# Altium schematic sheet Module Output Sockets.SchDoc: Module Output Sockets
size A2; DocumentNumber: 29; SheetNumber: 29; SheetTotal: 54
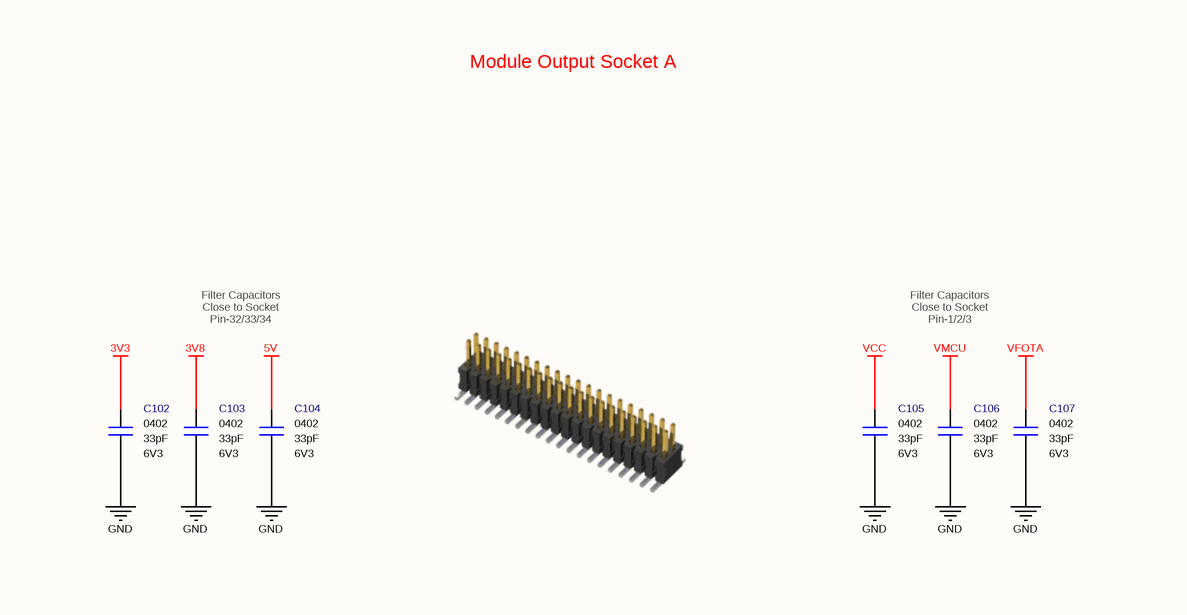
[diagram p0: Module Output Sockets.SchDoc, top left]
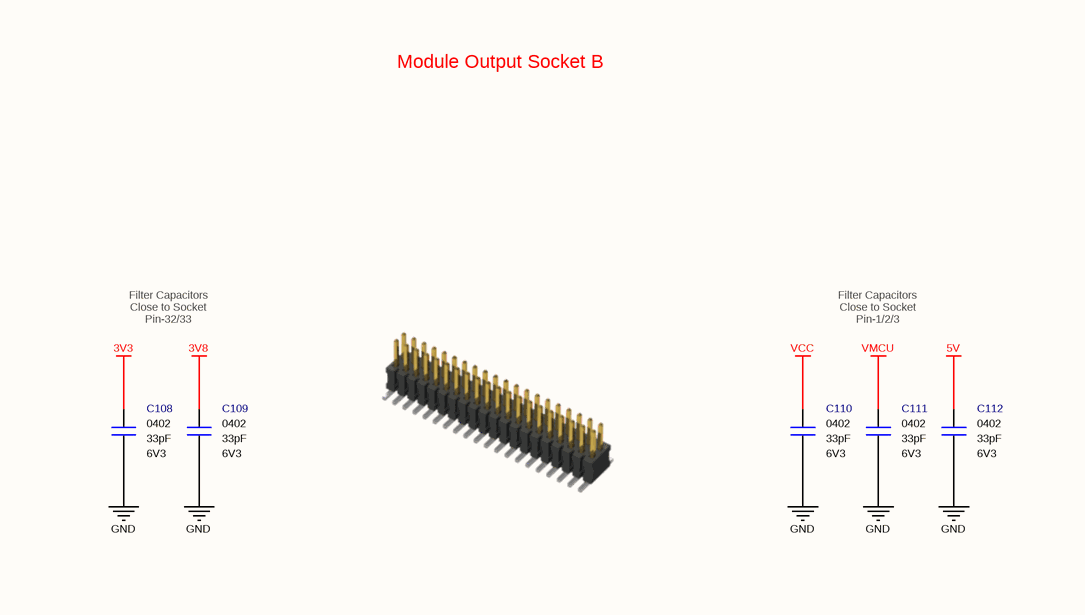
[diagram p1: Module Output Sockets.SchDoc, top right]
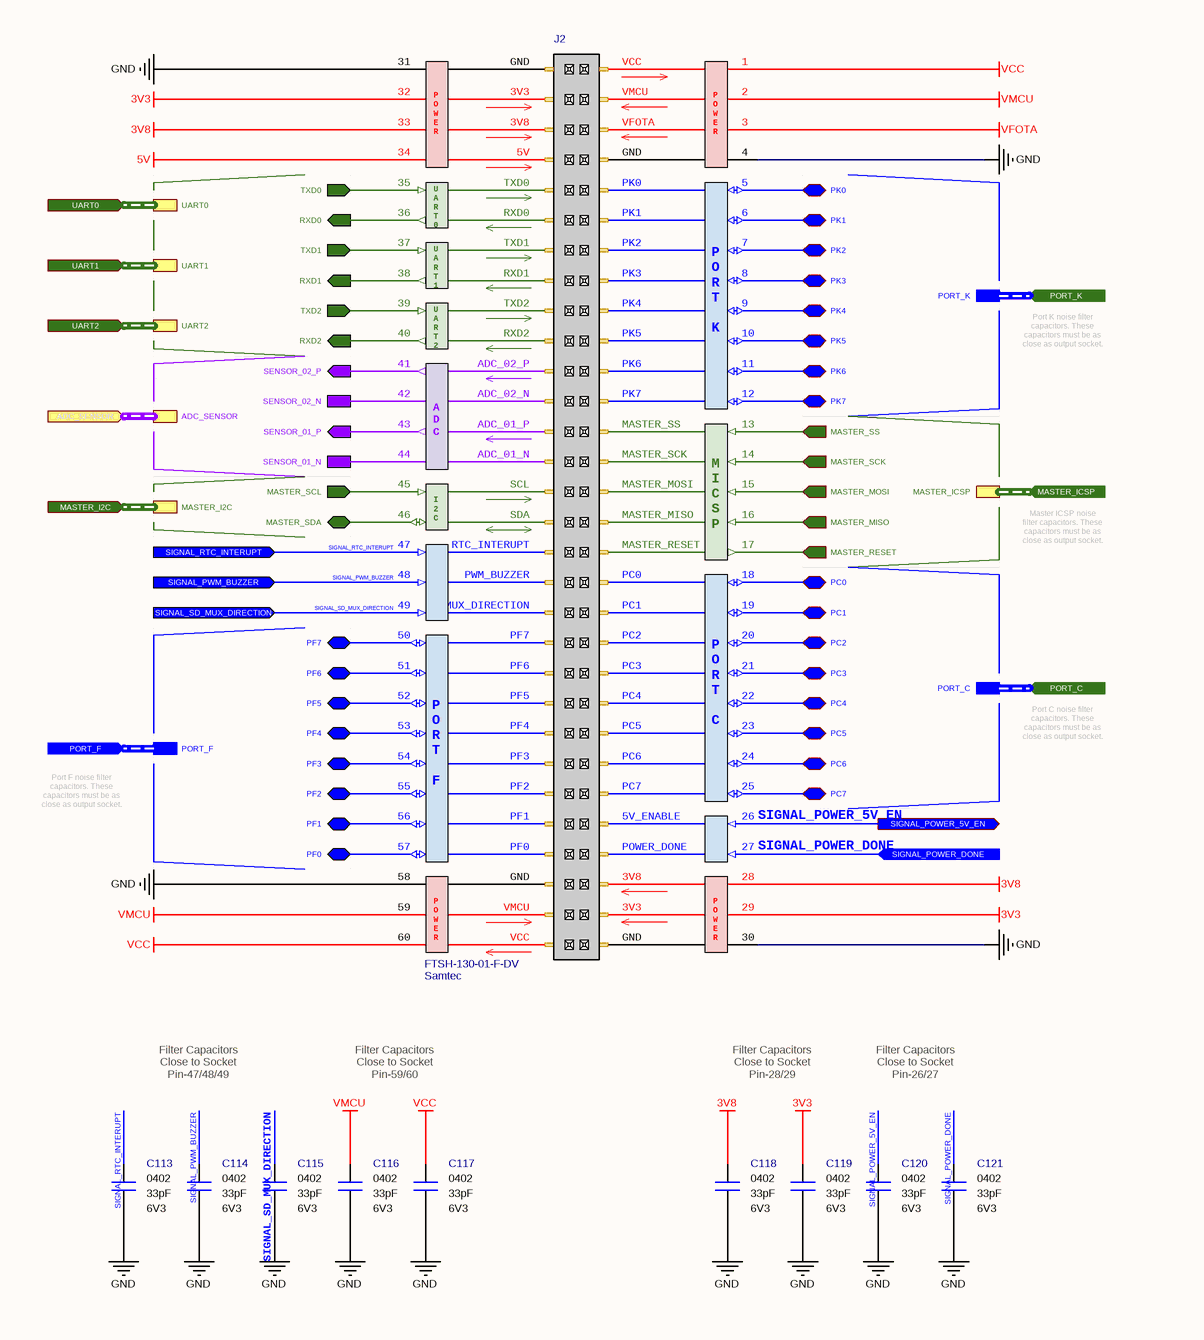
[diagram p2: Module Output Sockets.SchDoc, bottom left]
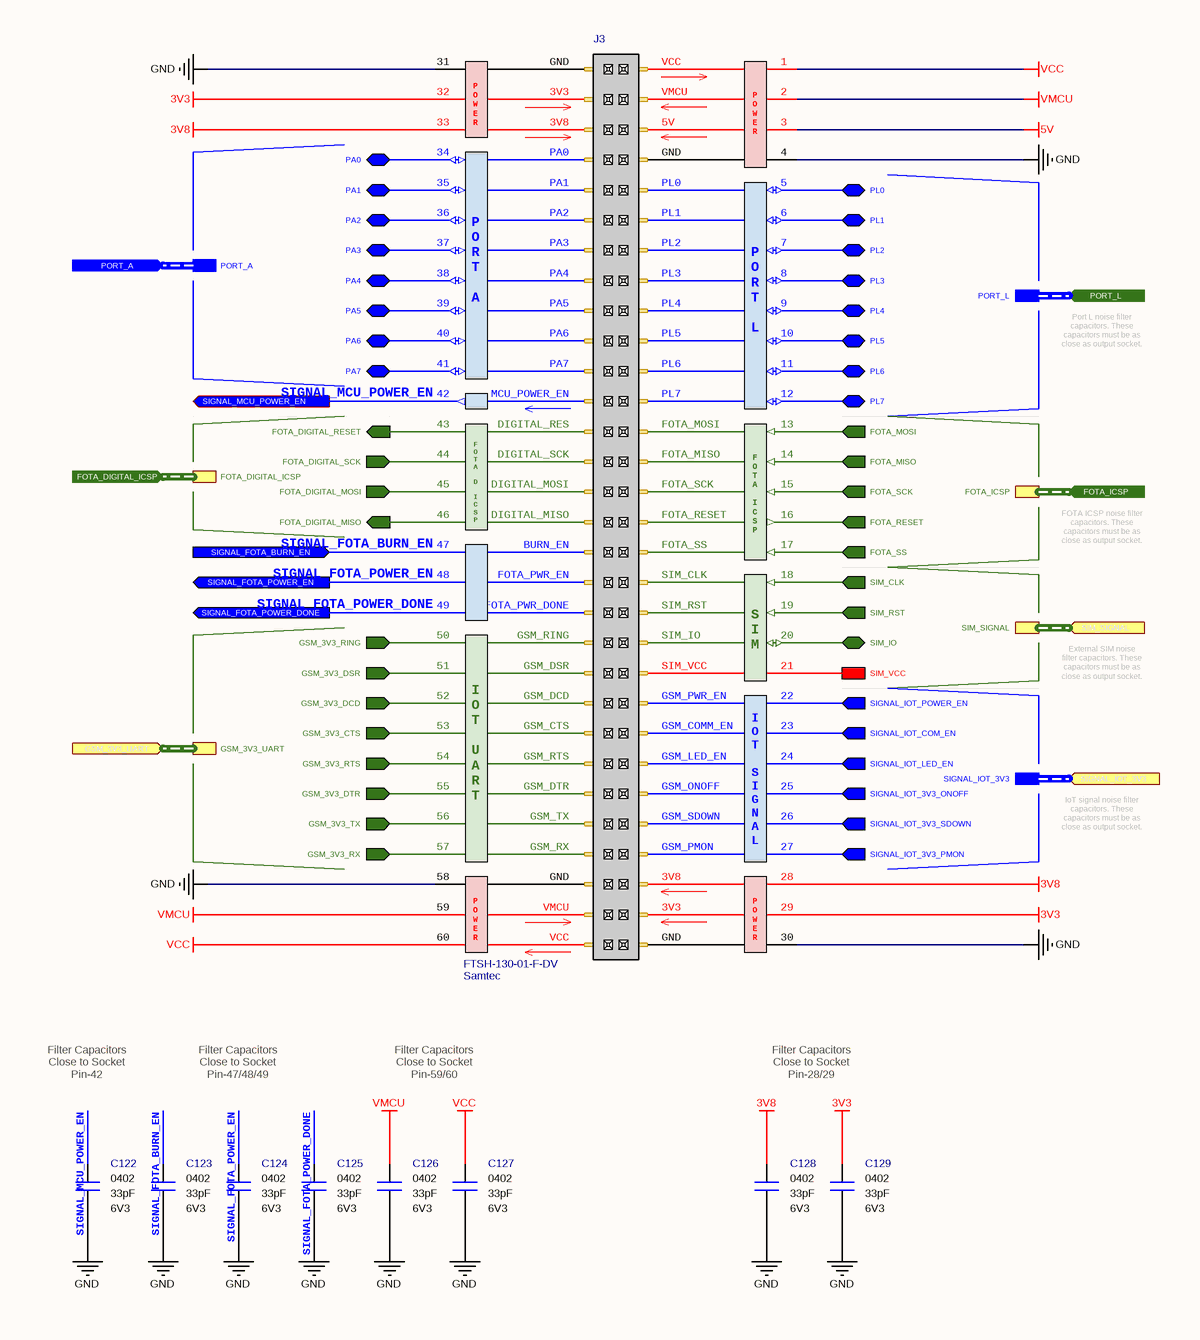
[diagram p3: Module Output Sockets.SchDoc, bottom right]

## Parts
C102  value 33pF  Case: 0402  Voltage: 6V3  [CAPACITOR_0402]  (hidden comment: Multilayer Ceramic Capacitor)
C103  value 33pF  Case: 0402  Voltage: 6V3  [CAPACITOR_0402]  (hidden comment: Multilayer Ceramic Capacitor)
C104  value 33pF  Case: 0402  Voltage: 6V3  [CAPACITOR_0402]  (hidden comment: Multilayer Ceramic Capacitor)
C105  value 33pF  Case: 0402  Voltage: 6V3  [CAPACITOR_0402]  (hidden comment: Multilayer Ceramic Capacitor)
C106  value 33pF  Case: 0402  Voltage: 6V3  [CAPACITOR_0402]  (hidden comment: Multilayer Ceramic Capacitor)
C107  value 33pF  Case: 0402  Voltage: 6V3  [CAPACITOR_0402]  (hidden comment: Multilayer Ceramic Capacitor)
C108  value 33pF  Case: 0402  Voltage: 6V3  [CAPACITOR_0402]  (hidden comment: Multilayer Ceramic Capacitor)
C109  value 33pF  Case: 0402  Voltage: 6V3  [CAPACITOR_0402]  (hidden comment: Multilayer Ceramic Capacitor)
C110  value 33pF  Case: 0402  Voltage: 6V3  [CAPACITOR_0402]  (hidden comment: Multilayer Ceramic Capacitor)
C111  value 33pF  Case: 0402  Voltage: 6V3  [CAPACITOR_0402]  (hidden comment: Multilayer Ceramic Capacitor)
C112  value 33pF  Case: 0402  Voltage: 6V3  [CAPACITOR_0402]  (hidden comment: Multilayer Ceramic Capacitor)
C113  value 33pF  Case: 0402  Voltage: 6V3  [CAPACITOR_0402]  (hidden comment: Multilayer Ceramic Capacitor)
C114  value 33pF  Case: 0402  Voltage: 6V3  [CAPACITOR_0402]  (hidden comment: Multilayer Ceramic Capacitor)
C115  value 33pF  Case: 0402  Voltage: 6V3  [CAPACITOR_0402]  (hidden comment: Multilayer Ceramic Capacitor)
C116  value 33pF  Case: 0402  Voltage: 6V3  [CAPACITOR_0402]  (hidden comment: Multilayer Ceramic Capacitor)
C117  value 33pF  Case: 0402  Voltage: 6V3  [CAPACITOR_0402]  (hidden comment: Multilayer Ceramic Capacitor)
C118  value 33pF  Case: 0402  Voltage: 6V3  [CAPACITOR_0402]  (hidden comment: Multilayer Ceramic Capacitor)
C119  value 33pF  Case: 0402  Voltage: 6V3  [CAPACITOR_0402]  (hidden comment: Multilayer Ceramic Capacitor)
C120  value 33pF  Case: 0402  Voltage: 6V3  [CAPACITOR_0402]  (hidden comment: Multilayer Ceramic Capacitor)
C121  value 33pF  Case: 0402  Voltage: 6V3  [CAPACITOR_0402]  (hidden comment: Multilayer Ceramic Capacitor)
C122  value 33pF  Case: 0402  Voltage: 6V3  [CAPACITOR_0402]  (hidden comment: Multilayer Ceramic Capacitor)
C123  value 33pF  Case: 0402  Voltage: 6V3  [CAPACITOR_0402]  (hidden comment: Multilayer Ceramic Capacitor)
C124  value 33pF  Case: 0402  Voltage: 6V3  [CAPACITOR_0402]  (hidden comment: Multilayer Ceramic Capacitor)
C125  value 33pF  Case: 0402  Voltage: 6V3  [CAPACITOR_0402]  (hidden comment: Multilayer Ceramic Capacitor)
C126  value 33pF  Case: 0402  Voltage: 6V3  [CAPACITOR_0402]  (hidden comment: Multilayer Ceramic Capacitor)
C127  value 33pF  Case: 0402  Voltage: 6V3  [CAPACITOR_0402]  (hidden comment: Multilayer Ceramic Capacitor)
C128  value 33pF  Case: 0402  Voltage: 6V3  [CAPACITOR_0402]  (hidden comment: Multilayer Ceramic Capacitor)
C129  value 33pF  Case: 0402  Voltage: 6V3  [CAPACITOR_0402]  (hidden comment: Multilayer Ceramic Capacitor)
J2  Manufacturer Part Number: FTSH-130-01-F-DV  Manufacturer Name: Samtec  [SAMTEC-FTSH-130-01-X-DV]  (hidden comment: 1.27 mm Pitch 2x30P Male Connector)
J3  Manufacturer Part Number: FTSH-130-01-F-DV  Manufacturer Name: Samtec  [SAMTEC-FTSH-130-01-X-DV]  (hidden comment: 1.27 mm Pitch 2x30P Male Connector)

## Sub-sheets
ADC Sensor Filter Capacitors = Filter Capacitors - ADC Sensor.SchDoc: ADC_SENSOR (harness ADC_SENSOR), SENSOR_01_N, SENSOR_01_P (in), SENSOR_02_N, SENSOR_02_P (in)
FOTA Digital ICSP Filter Capacitors = Filter Capacitors - FOTA Digital ICSP.SchDoc: FOTA_DIGITAL_ICSP (harness FOTA_DIGITAL_ICSP), FOTA_DIGITAL_MISO (in), FOTA_DIGITAL_MOSI (out), FOTA_DIGITAL_SCK (out), FOTA_DIGITAL_RESET (in)
FOTA ICSP Filter Capacitors = Filter Capacitors - FOTA ICSP.SchDoc: FOTA_ICSP (harness FOTA_ICSP), FOTA_MOSI (out), FOTA_SS (out), FOTA_MISO (out), FOTA_SCK (out), FOTA_RESET (out)
I2C Filter Capacitors = Filter Capacitors - I2C.SchDoc: MASTER_I2C (harness MASTER_I2C), MASTER_SDA (bidir), MASTER_SCL (out)
IoT UART Filter Capacitors = Filter Capacitors - IoT UART.SchDoc: GSM_3V3_UART (harness GSM_3V3_UART), GSM_3V3_RTS (out), GSM_3V3_RING (out), GSM_3V3_CTS (out), GSM_3V3_DTR (out), GSM_3V3_DCD (out), GSM_3V3_RX (out), GSM_3V3_DSR (out), GSM_3V3_TX (out)
Master ICSP Filter Capacitors = Filter Capacitors - Master ICSP.SchDoc: MASTER_ICSP (harness MASTER_ICSP), MASTER_SS (out), MASTER_RESET (out), MASTER_SCK (out), MASTER_MOSI (out), MASTER_MISO (out)
PORT A Filter Capacitors = Filter Capacitors - Port A.SchDoc: PA4 (bidir), PA2 (bidir), PA0 (bidir), PA5 (bidir), PA3 (bidir), PA1 (bidir), PA7 (bidir), PA6 (bidir), PORT_A (harness PORT_A)
PORT C Filter Capacitors = Filter Capacitors - Port C.SchDoc: PC4 (bidir), PC2 (bidir), PC0 (bidir), PC5 (bidir), PC3 (bidir), PC1 (bidir), PC7 (bidir), PC6 (bidir), PORT_C (harness PORT_C)
PORT F Filter Capacitors = Filter Capacitors - Port F.SchDoc: PF4 (bidir), PF2 (bidir), PF0 (bidir), PF5 (bidir), PF3 (bidir), PF1 (bidir), PF7 (bidir), PF6 (bidir), PORT_F (harness PORT_F)
PORT K Filter Capacitors = Filter Capacitors - Port K.SchDoc: PK4 (bidir), PK2 (bidir), PK0 (bidir), PK5 (bidir), PK3 (bidir), PK1 (bidir), PK7 (bidir), PK6 (bidir), PORT_K (harness PORT_K)
PORT L Filter Capacitors = Filter Capacitors - Port L.SchDoc: PL4 (bidir), PL2 (bidir), PL0 (bidir), PL5 (bidir), PL3 (bidir), PL1 (bidir), PL7 (bidir), PL6 (bidir), PORT_L (harness PORT_L)
Serial Communication Filter Capacitors = Filter Capacitors - Serial Communication.SchDoc: UART0 (harness UART0), TXD2 (out), UART2 (harness UART2), TXD1 (out), RXD1 (in), RXD0 (in), TXD0 (out), UART1 (harness UART1), RXD2 (in)
Signal IoT Filter Capacitors = Filter Capacitors - Signal IoT.SchDoc: SIGNAL_IOT_3V3_SDOWN (out), SIGNAL_IOT_LED_EN (out), SIGNAL_IOT_POWER_EN (out), SIGNAL_IOT_3V3_PMON (out), SIGNAL_IOT_3V3_ONOFF (out), SIGNAL_IOT_COM_EN (out), SIGNAL_IOT_3V3 (harness SIGNAL_IOT_3V3)
SIM Signal Filter Capacitors = Filter Capacitors - External SIM.SchDoc: SIM_SIGNAL (harness SIM_SIGNAL), SIM_CLK (out), SIM_RST (out), SIM_IO (bidir), SIM_VCC

## Ports
ADC_SENSOR (in, harness ADC_SENSOR), FOTA_DIGITAL_ICSP (in, harness FOTA_DIGITAL_ICSP), FOTA_ICSP (in, harness FOTA_ICSP), GSM_3V3_UART (in, harness GSM_3V3_UART), MASTER_I2C (in, harness MASTER_I2C), MASTER_ICSP (in, harness MASTER_ICSP), PORT_A (in, harness PORT_A), PORT_C (in, harness PORT_C), PORT_F (in, harness PORT_F), PORT_K (in, harness PORT_K), PORT_L (in, harness PORT_L), SIGNAL_FOTA_BURN_EN (in), SIGNAL_FOTA_POWER_DONE (out), SIGNAL_FOTA_POWER_EN (out), SIGNAL_IOT_3V3 (in, harness SIGNAL_IOT_3V3), SIGNAL_MCU_POWER_EN (out), SIGNAL_POWER_5V_EN (out), SIGNAL_POWER_DONE (in), SIGNAL_PWM_BUZZER (in), SIGNAL_RTC_INTERUPT (in), SIGNAL_SD_MUX_DIRECTION (in), SIM_SIGNAL (in, harness SIM_SIGNAL), UART0 (in, harness UART0), UART1 (in, harness UART1), UART2 (in, harness UART2)

## Nets
3V3: C102.2 C108.2 C119.2 C129.2 J2.29(Pin-29) J2.32(Pin-32) J3.29(Pin-29) J3.32(Pin-32)
3V8: C103.2 C109.2 C118.2 C128.2 J2.28(Pin-28) J2.33(Pin-33) J3.28(Pin-28) J3.33(Pin-33)
5V: C104.2 C112.2 J2.34(Pin-34) J3.3(Pin-3)
GND: C102.1 C103.1 C104.1 C105.1 C106.1 C107.1 C108.1 C109.1 C110.1 C111.1 C112.1 C113.1 C114.1 C115.1 C116.1 C117.1 C118.1 C119.1 C120.1 C121.1 C122.1 C123.1 C124.1 C125.1 C126.1 C127.1 C128.1 C129.1 J2.4(Pin-4) J2.30(Pin-30) J2.31(Pin-31) J2.58(Pin-58) J3.4(Pin-4) J3.30(Pin-30) J3.31(Pin-31) J3.58(Pin-58)
VCC: C105.2 C110.2 C117.2 C127.2 J2.1(Pin-1) J2.60(Pin-60) J3.1(Pin-1) J3.60(Pin-60)
VFOTA: C107.2 J2.3(Pin-3)
VMCU: C106.2 C111.2 C116.2 C126.2 J2.2(Pin-2) J2.59(Pin-59) J3.2(Pin-2) J3.59(Pin-59)
SIGNAL_FOTA_BURN_EN: C123.2 J3.47(Pin-47) ; port SIGNAL_FOTA_BURN_EN
SIGNAL_FOTA_POWER_DONE: C125.2 J3.49(Pin-49) ; port SIGNAL_FOTA_POWER_DONE
SIGNAL_FOTA_POWER_EN: C124.2 J3.48(Pin-48) ; port SIGNAL_FOTA_POWER_EN
SIGNAL_MCU_POWER_EN: C122.2 J3.42(Pin-42) ; port SIGNAL_MCU_POWER_EN
SIGNAL_POWER_5V_EN: C120.2 J2.26(Pin-26) ; port SIGNAL_POWER_5V_EN
SIGNAL_POWER_DONE: C121.2 J2.27(Pin-27) ; port SIGNAL_POWER_DONE
SIGNAL_PWM_BUZZER: C114.2 J2.48(Pin-48) ; port SIGNAL_PWM_BUZZER
SIGNAL_RTC_INTERUPT: C113.2 J2.47(Pin-47) ; port SIGNAL_RTC_INTERUPT
SIGNAL_SD_MUX_DIRECTION: C115.2 J2.49(Pin-49) ; port SIGNAL_SD_MUX_DIRECTION
NetJ2_5: J2.5(Pin-5) ; sheet PORT K Filter Capacitors/PK0
NetJ2_6: J2.6(Pin-6) ; sheet PORT K Filter Capacitors/PK1
NetJ2_7: J2.7(Pin-7) ; sheet PORT K Filter Capacitors/PK2
NetJ2_8: J2.8(Pin-8) ; sheet PORT K Filter Capacitors/PK3
NetJ2_9: J2.9(Pin-9) ; sheet PORT K Filter Capacitors/PK4
NetJ2_10: J2.10(Pin-10) ; sheet PORT K Filter Capacitors/PK5
NetJ2_11: J2.11(Pin-11) ; sheet PORT K Filter Capacitors/PK6
NetJ2_12: J2.12(Pin-12) ; sheet PORT K Filter Capacitors/PK7
NetJ2_13: J2.13(Pin-13) ; sheet Master ICSP Filter Capacitors/MASTER_SS
NetJ2_14: J2.14(Pin-14) ; sheet Master ICSP Filter Capacitors/MASTER_SCK
NetJ2_15: J2.15(Pin-15) ; sheet Master ICSP Filter Capacitors/MASTER_MOSI
NetJ2_16: J2.16(Pin-16) ; sheet Master ICSP Filter Capacitors/MASTER_MISO
NetJ2_17: J2.17(Pin-17) ; sheet Master ICSP Filter Capacitors/MASTER_RESET
NetJ2_18: J2.18(Pin-18) ; sheet PORT C Filter Capacitors/PC0
NetJ2_19: J2.19(Pin-19) ; sheet PORT C Filter Capacitors/PC1
NetJ2_20: J2.20(Pin-20) ; sheet PORT C Filter Capacitors/PC2
NetJ2_21: J2.21(Pin-21) ; sheet PORT C Filter Capacitors/PC3
NetJ2_22: J2.22(Pin-22) ; sheet PORT C Filter Capacitors/PC4
NetJ2_23: J2.23(Pin-23) ; sheet PORT C Filter Capacitors/PC5
NetJ2_24: J2.24(Pin-24) ; sheet PORT C Filter Capacitors/PC6
NetJ2_25: J2.25(Pin-25) ; sheet PORT C Filter Capacitors/PC7
NetJ2_35: J2.35(Pin-35) ; sheet Serial Communication Filter Capacitors/TXD0
NetJ2_36: J2.36(Pin-36) ; sheet Serial Communication Filter Capacitors/RXD0
NetJ2_37: J2.37(Pin-37) ; sheet Serial Communication Filter Capacitors/TXD1
NetJ2_38: J2.38(Pin-38) ; sheet Serial Communication Filter Capacitors/RXD1
NetJ2_39: J2.39(Pin-39) ; sheet Serial Communication Filter Capacitors/TXD2
NetJ2_40: J2.40(Pin-40) ; sheet Serial Communication Filter Capacitors/RXD2
NetJ2_41: J2.41(Pin-41) ; sheet ADC Sensor Filter Capacitors/SENSOR_02_P
NetJ2_42: J2.42(Pin-42) ; sheet ADC Sensor Filter Capacitors/SENSOR_02_N
NetJ2_43: J2.43(Pin-43) ; sheet ADC Sensor Filter Capacitors/SENSOR_01_P
NetJ2_44: J2.44(Pin-44) ; sheet ADC Sensor Filter Capacitors/SENSOR_01_N
NetJ2_45: J2.45(Pin-45) ; sheet I2C Filter Capacitors/MASTER_SCL
NetJ2_46: J2.46(Pin-46) ; sheet I2C Filter Capacitors/MASTER_SDA
NetJ2_50: J2.50(Pin-50) ; sheet PORT F Filter Capacitors/PF7
NetJ2_51: J2.51(Pin-51) ; sheet PORT F Filter Capacitors/PF6
NetJ2_52: J2.52(Pin-52) ; sheet PORT F Filter Capacitors/PF5
NetJ2_53: J2.53(Pin-53) ; sheet PORT F Filter Capacitors/PF4
NetJ2_54: J2.54(Pin-54) ; sheet PORT F Filter Capacitors/PF3
NetJ2_55: J2.55(Pin-55) ; sheet PORT F Filter Capacitors/PF2
NetJ2_56: J2.56(Pin-56) ; sheet PORT F Filter Capacitors/PF1
NetJ2_57: J2.57(Pin-57) ; sheet PORT F Filter Capacitors/PF0
NetJ3_5: J3.5(Pin-5) ; sheet PORT L Filter Capacitors/PL0
NetJ3_6: J3.6(Pin-6) ; sheet PORT L Filter Capacitors/PL1
NetJ3_7: J3.7(Pin-7) ; sheet PORT L Filter Capacitors/PL2
NetJ3_8: J3.8(Pin-8) ; sheet PORT L Filter Capacitors/PL3
NetJ3_9: J3.9(Pin-9) ; sheet PORT L Filter Capacitors/PL4
NetJ3_10: J3.10(Pin-10) ; sheet PORT L Filter Capacitors/PL5
NetJ3_11: J3.11(Pin-11) ; sheet PORT L Filter Capacitors/PL6
NetJ3_12: J3.12(Pin-12) ; sheet PORT L Filter Capacitors/PL7
NetJ3_13: J3.13(Pin-13) ; sheet FOTA ICSP Filter Capacitors/FOTA_MOSI
NetJ3_14: J3.14(Pin-14) ; sheet FOTA ICSP Filter Capacitors/FOTA_MISO
NetJ3_15: J3.15(Pin-15) ; sheet FOTA ICSP Filter Capacitors/FOTA_SCK
NetJ3_16: J3.16(Pin-16) ; sheet FOTA ICSP Filter Capacitors/FOTA_RESET
NetJ3_17: J3.17(Pin-17) ; sheet FOTA ICSP Filter Capacitors/FOTA_SS
NetJ3_18: J3.18(Pin-18) ; sheet SIM Signal Filter Capacitors/SIM_CLK
NetJ3_19: J3.19(Pin-19) ; sheet SIM Signal Filter Capacitors/SIM_RST
NetJ3_20: J3.20(Pin-20) ; sheet SIM Signal Filter Capacitors/SIM_IO
NetJ3_21: J3.21(Pin-21) ; sheet SIM Signal Filter Capacitors/SIM_VCC
NetJ3_22: J3.22(Pin-22) ; sheet Signal IoT Filter Capacitors/SIGNAL_IOT_POWER_EN
NetJ3_23: J3.23(Pin-23) ; sheet Signal IoT Filter Capacitors/SIGNAL_IOT_COM_EN
NetJ3_24: J3.24(Pin-24) ; sheet Signal IoT Filter Capacitors/SIGNAL_IOT_LED_EN
NetJ3_25: J3.25(Pin-25) ; sheet Signal IoT Filter Capacitors/SIGNAL_IOT_3V3_ONOFF
NetJ3_26: J3.26(Pin-26) ; sheet Signal IoT Filter Capacitors/SIGNAL_IOT_3V3_SDOWN
NetJ3_27: J3.27(Pin-27) ; sheet Signal IoT Filter Capacitors/SIGNAL_IOT_3V3_PMON
NetJ3_34: J3.34(Pin-34) ; sheet PORT A Filter Capacitors/PA0
NetJ3_35: J3.35(Pin-35) ; sheet PORT A Filter Capacitors/PA1
NetJ3_36: J3.36(Pin-36) ; sheet PORT A Filter Capacitors/PA2
NetJ3_37: J3.37(Pin-37) ; sheet PORT A Filter Capacitors/PA3
NetJ3_38: J3.38(Pin-38) ; sheet PORT A Filter Capacitors/PA4
NetJ3_39: J3.39(Pin-39) ; sheet PORT A Filter Capacitors/PA5
NetJ3_40: J3.40(Pin-40) ; sheet PORT A Filter Capacitors/PA6
NetJ3_41: J3.41(Pin-41) ; sheet PORT A Filter Capacitors/PA7
NetJ3_43: J3.43(Pin-43) ; sheet FOTA Digital ICSP Filter Capacitors/FOTA_DIGITAL_RESET
NetJ3_44: J3.44(Pin-44) ; sheet FOTA Digital ICSP Filter Capacitors/FOTA_DIGITAL_SCK
NetJ3_45: J3.45(Pin-45) ; sheet FOTA Digital ICSP Filter Capacitors/FOTA_DIGITAL_MOSI
NetJ3_46: J3.46(Pin-46) ; sheet FOTA Digital ICSP Filter Capacitors/FOTA_DIGITAL_MISO
NetJ3_50: J3.50(Pin-50) ; sheet IoT UART Filter Capacitors/GSM_3V3_RING
NetJ3_51: J3.51(Pin-51) ; sheet IoT UART Filter Capacitors/GSM_3V3_DSR
NetJ3_52: J3.52(Pin-52) ; sheet IoT UART Filter Capacitors/GSM_3V3_DCD
NetJ3_53: J3.53(Pin-53) ; sheet IoT UART Filter Capacitors/GSM_3V3_CTS
NetJ3_54: J3.54(Pin-54) ; sheet IoT UART Filter Capacitors/GSM_3V3_RTS
NetJ3_55: J3.55(Pin-55) ; sheet IoT UART Filter Capacitors/GSM_3V3_DTR
NetJ3_56: J3.56(Pin-56) ; sheet IoT UART Filter Capacitors/GSM_3V3_TX
NetJ3_57: J3.57(Pin-57) ; sheet IoT UART Filter Capacitors/GSM_3V3_RX

## Buses and harness runs
harness port ADC_SENSOR = sheet ADC Sensor Filter Capacitors/ADC_SENSOR
harness port FOTA_DIGITAL_ICSP = sheet FOTA Digital ICSP Filter Capacitors/FOTA_DIGITAL_ICSP
harness port FOTA_ICSP = sheet FOTA ICSP Filter Capacitors/FOTA_ICSP
harness port GSM_3V3_UART = sheet IoT UART Filter Capacitors/GSM_3V3_UART
harness port MASTER_I2C = sheet I2C Filter Capacitors/MASTER_I2C
harness port MASTER_ICSP = sheet Master ICSP Filter Capacitors/MASTER_ICSP
harness port PORT_A = sheet PORT A Filter Capacitors/PORT_A
harness port PORT_C = sheet PORT C Filter Capacitors/PORT_C
harness port PORT_F = sheet PORT F Filter Capacitors/PORT_F
harness port PORT_K = sheet PORT K Filter Capacitors/PORT_K
harness port PORT_L = sheet PORT L Filter Capacitors/PORT_L
harness port SIGNAL_IOT_3V3 = sheet Signal IoT Filter Capacitors/SIGNAL_IOT_3V3
harness port SIM_SIGNAL = sheet SIM Signal Filter Capacitors/SIM_SIGNAL
harness port UART0 = sheet Serial Communication Filter Capacitors/UART0
harness port UART1 = sheet Serial Communication Filter Capacitors/UART1
harness port UART2 = sheet Serial Communication Filter Capacitors/UART2

## Notes on the sheet
- Module Output Socket A
- Module Output Socket B
- Filter Capacitors
  Close to Socket
  Pin-32/33/34
- Filter Capacitors
  Close to Socket
  Pin-1/2/3
- Filter Capacitors
  Close to Socket
  Pin-32/33
- Port K noise filter capacitors. These capacitors must be as close as output socket.
- Port L noise filter capacitors. These capacitors must be as close as output socket.
- Master ICSP noise filter capacitors. These capacitors must be as close as output socket.
- FOTA ICSP noise filter capacitors. These capacitors must be as close as output socket.
- External SIM noise filter capacitors. These capacitors must be as close as output socket.
- Port C noise filter capacitors. These capacitors must be as close as output socket.
- Port F noise filter capacitors. These capacitors must be as close as output socket.
- IoT signal noise filter capacitors. These capacitors must be as close as output socket.
- Filter Capacitors
  Close to Socket
  Pin-47/48/49
- Filter Capacitors
  Close to Socket
  Pin-59/60
- Filter Capacitors
  Close to Socket
  Pin-28/29
- Filter Capacitors
  Close to Socket
  Pin-26/27
- Filter Capacitors
  Close to Socket
  Pin-42
- Title
- Size:
- Date:
- File:
- A2
- Number:
- Time:
- Revision:
- Sheet
- of
- (in symbol Connector - B100 Male Socket [A]) GND; VCC; 3V3; VMCU; 3V8; VFOTA; 5V; / P / O / W / E / R; TXD0; PK0; RXD0; PK1; U / A / R / T / 0; TXD1; PK2; RXD1; PK3; U / A / R / T / 1; TXD2; PK4; RXD2; PK5; U / A / R / T / 2; ADC_02_P; PK6; ADC_02_N; PK7; / P / O / R / T / K; ADC_01_P; MASTER_SS; ADC_01_N; MASTER_SCK; / A / D / C; SCL; MASTER_MOSI; SDA; MASTER_MISO; / I / 2 / C; RTC_INTERUPT; MASTER_RESET; / M / I / C / S / P; PWM_BUZZER; PC0; MUX_DIRECTION; PC1; PF7; PC2; PF6; PC3; PF5; PC4; PF4; PC5; PF3; PC6; PF2; PC7; / P / O / R / T / C; PF1; 5V_ENABLE; PF0; POWER_DONE; / P / O / R / T / F
- (in symbol Connector - B100 Male Socket [B]) GND; VCC; 3V3; VMCU; 3V8; 5V; / P / O / W / E / R; PA0; PA1; PL0; PA2; PL1; PA3; PL2; PA4; PL3; PA5; PL4; PA6; PL5; PA7; PL6; / P / O / R / T / A; MCU_POWER_EN; PL7; / P / O / R / T / L; DIGITAL_RES; FOTA_MOSI; DIGITAL_SCK; FOTA_MISO; DIGITAL_MOSI; FOTA_SCK; DIGITAL_MISO; FOTA_RESET; / F / O / T / A / D / I / C / S / P; BURN_EN; FOTA_SS; / F / O / T / A / I / C / S / P; FOTA_PWR_EN; SIM_CLK; FOTA_PWR_DONE; SIM_RST; GSM_RING; SIM_IO; GSM_DSR; SIM_VCC; / S / I / M; GSM_DCD; GSM_PWR_EN; GSM_CTS; GSM_COMM_EN; GSM_RTS; GSM_LED_EN; GSM_DTR; GSM_ONOFF; GSM_TX; GSM_SDOWN; GSM_RX; GSM_PMON; / I / O / T / U / A / R / T; / I / O / T / S / I / G / N / A / L

## Library data of the parts
C102-C129 = Capacitor - 33pF [0402-6V3]: Capacitor - 33pF [0402] (Ceramic); Manufacturer Name: Kemet; Manufacturer Part Number: C0402C330J9RACAUTO; Dielectric: X7R; Tolerance: 10%; Height: 0.5mm; Maximum Operating Temperature: +125; Minimum Operating Temperature: -55; ROHS: Yes; ComponentLink1Description: DataSheet; ComponentLink1URL: https://api.kemet.com/component-edge/download/datasheet/C0402C330J9RACAUTO.pdf; ComponentLink2Description: Mouser; ComponentLink2URL: https://www.mouser.com/Search/Refine.aspx?Keyword=80-C0402C330J9RAUTO; Supplier 1: Mouser; Supplier Part Number 1: 80-C0402C330J9RAUTO; Mouser Part Number: 80-C0402C330J9RAUTO
J2 = Connector - B100 Male Socket [A]: Headers & Wire Housings BREAKAWAY HDR VERT 6; Position: 60; Row: 2; Pitch: 1.27 mm; Mouser Part Number: 200-FTSH13001FDV; ROHS: Yes; ComponentLink1Description: DataSheet; ComponentLink1URL: https://www.mouser.com.tr/datasheet/2/527/ftsh_smt-1316912.pdf; ComponentLink2Description: Mouser; ComponentLink2URL: https://www.mouser.com.tr/ProductDetail/Samtec/FTSH-130-01-F-DV/?qs=0lQeLiL1qyaY5IDZ3XEJJA%3D%3D; Supplier 1: Mouser; Supplier Part Number 1: 200-FTSH13001FDV; Case: SMD
J3 = Connector - B100 Male Socket [B]: Headers & Wire Housings BREAKAWAY HDR VERT 6; Position: 60; Row: 2; Pitch: 1.27 mm; Mouser Part Number: 200-FTSH13001FDV; ROHS: Yes; ComponentLink1Description: DataSheet; ComponentLink1URL: https://www.mouser.com.tr/datasheet/2/527/ftsh_smt-1316912.pdf; ComponentLink2Description: Mouser; ComponentLink2URL: https://www.mouser.com.tr/ProductDetail/Samtec/FTSH-130-01-F-DV/?qs=0lQeLiL1qyaY5IDZ3XEJJA%3D%3D; Supplier 1: Mouser; Supplier Part Number 1: 200-FTSH13001FDV; Case: SMD